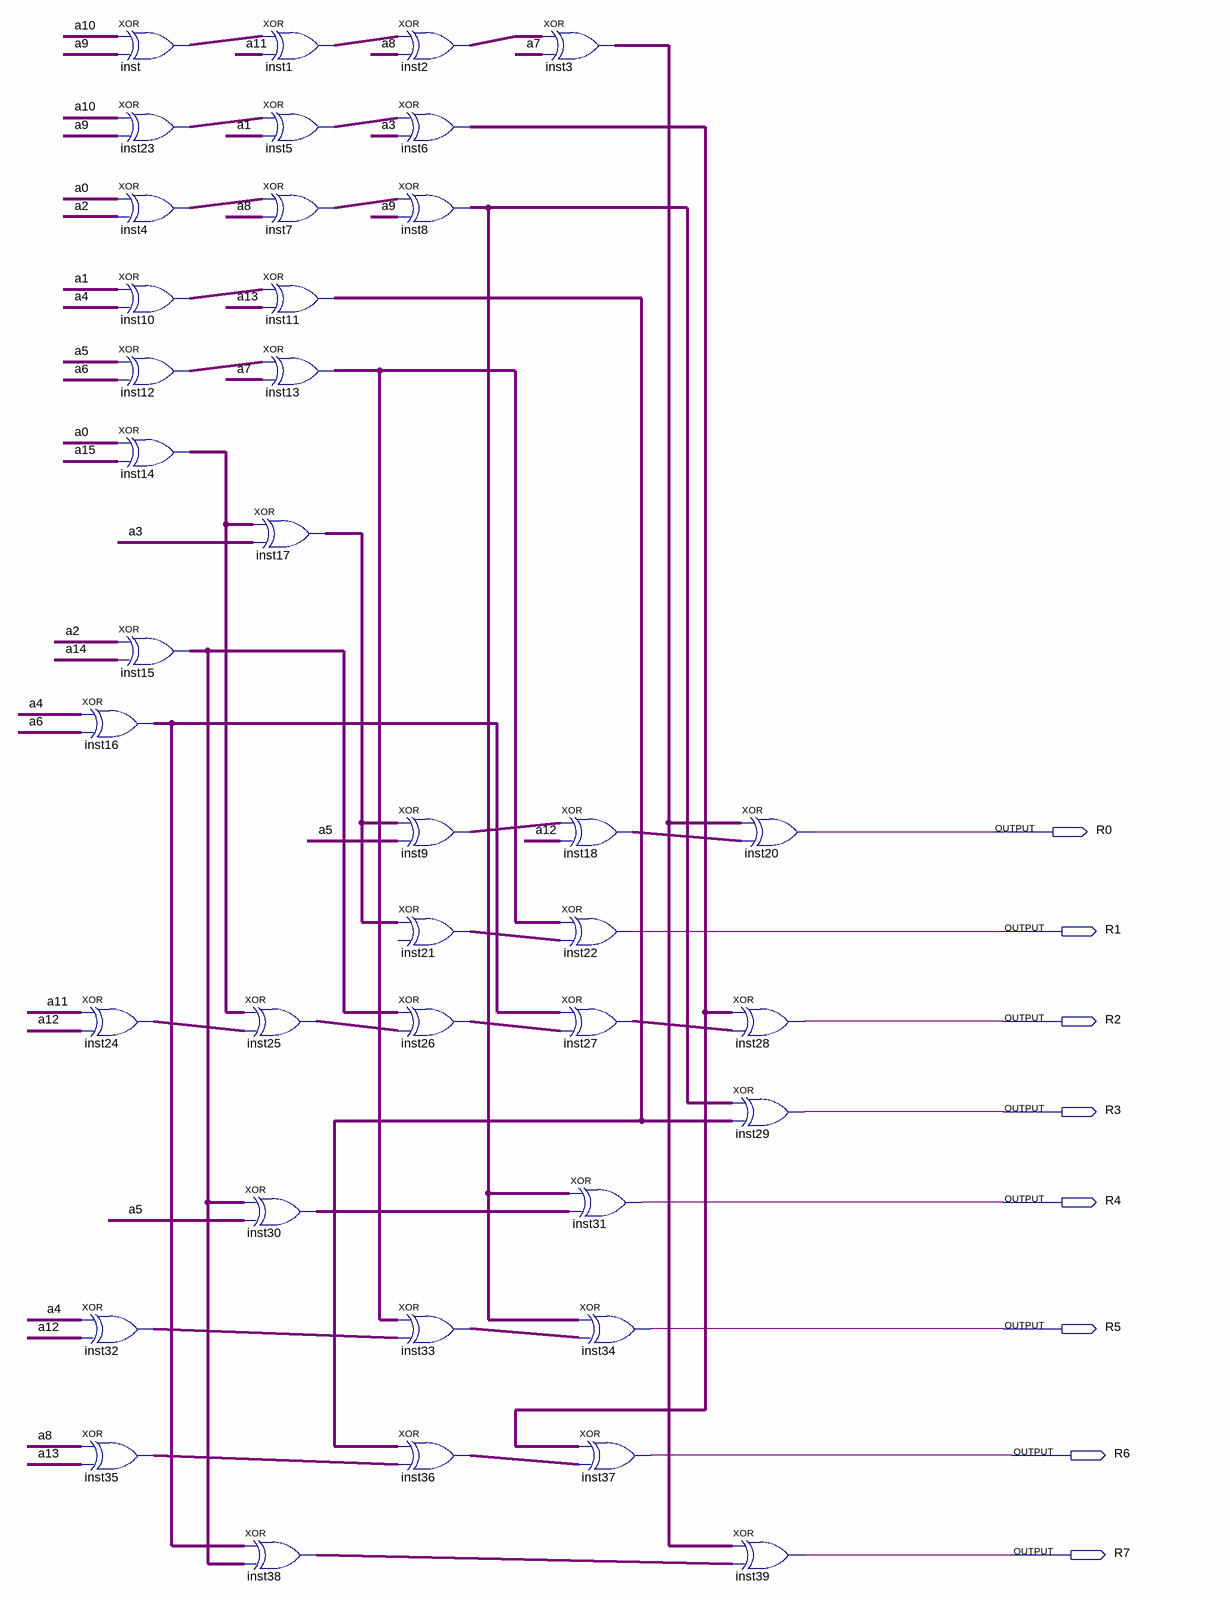
[diagram p0: schematic sheet]
// Quartus schematic encoderV3_Desenho.bdf as structural Verilog: 39 symbols, 8 pins
module encoderV3_Desenho (
  output R0,
  output R1,
  output R2,
  output R3,
  output R4,
  output R5,
  output R6,
  output R7
);

  wire a0, a1, a2, a3, a4, a5, a6, a7, a8, a9, a10, a11, a12, a13, a14, a15, inst1_out, inst2_out, inst3_out,
       inst4_out, inst5_out, inst6_out, inst7_out, inst8_out, inst9_out, inst10_out, inst11_out, inst12_out,
       inst13_out, inst14_out, inst15_out, inst16_out, inst17_out, inst18_out, inst21_out, inst23_out,
       inst24_out, inst25_out, inst26_out, inst27_out, inst30_out, inst32_out, inst33_out, inst35_out,
       inst36_out, inst38_out, inst_out;

  xor inst (inst_out, a10, a9);
  xor inst23 (inst23_out, a10, a9);
  xor inst4 (inst4_out, a0, a2);
  xor inst10 (inst10_out, a1, a4);
  xor inst12 (inst12_out, a5, a6);
  xor inst14 (inst14_out, a0, a15);
  xor inst15 (inst15_out, a2, a14);
  xor inst16 (inst16_out, a4, a6);
  xor inst24 (inst24_out, a11, a12);
  xor inst32 (inst32_out, a4, a12);
  xor inst35 (inst35_out, a8, a13);
  xor inst1 (inst1_out, inst_out, a11);
  xor inst5 (inst5_out, inst23_out, a1);
  xor inst7 (inst7_out, inst4_out, a8);
  xor inst11 (inst11_out, inst10_out, a13);
  xor inst13 (inst13_out, inst12_out, a7);
  xor inst17 (inst17_out, inst14_out, a3);
  xor inst25 (inst25_out, inst14_out, inst24_out);
  xor inst30 (inst30_out, inst15_out, a5);
  xor inst38 (inst38_out, inst16_out, inst15_out);
  xor inst2 (inst2_out, inst1_out, a8);
  xor inst6 (inst6_out, inst5_out, a3);
  xor inst8 (inst8_out, inst7_out, a9);
  xor inst9 (inst9_out, inst17_out, a5);
  buf inst21 (inst21_out, inst17_out);  // XOR open: IN2
  xor inst26 (inst26_out, inst15_out, inst25_out);
  xor inst33 (inst33_out, inst13_out, inst32_out);
  xor inst36 (inst36_out, inst11_out, inst35_out);
  xor inst3 (inst3_out, inst2_out, a7);
  xor inst18 (inst18_out, inst9_out, a12);
  xor inst22 (R1, inst13_out, inst21_out);
  xor inst27 (inst27_out, inst16_out, inst26_out);
  xor inst31 (R4, inst8_out, inst30_out);
  xor inst34 (R5, inst8_out, inst33_out);
  xor inst37 (R6, inst6_out, inst36_out);
  xor inst20 (R0, inst3_out, inst18_out);
  xor inst28 (R2, inst6_out, inst27_out);
  xor inst29 (R3, inst8_out, inst11_out);
  xor inst39 (R7, inst3_out, inst38_out);
endmodule
